# EAGLE design display-demo (EAGLE 4.16)
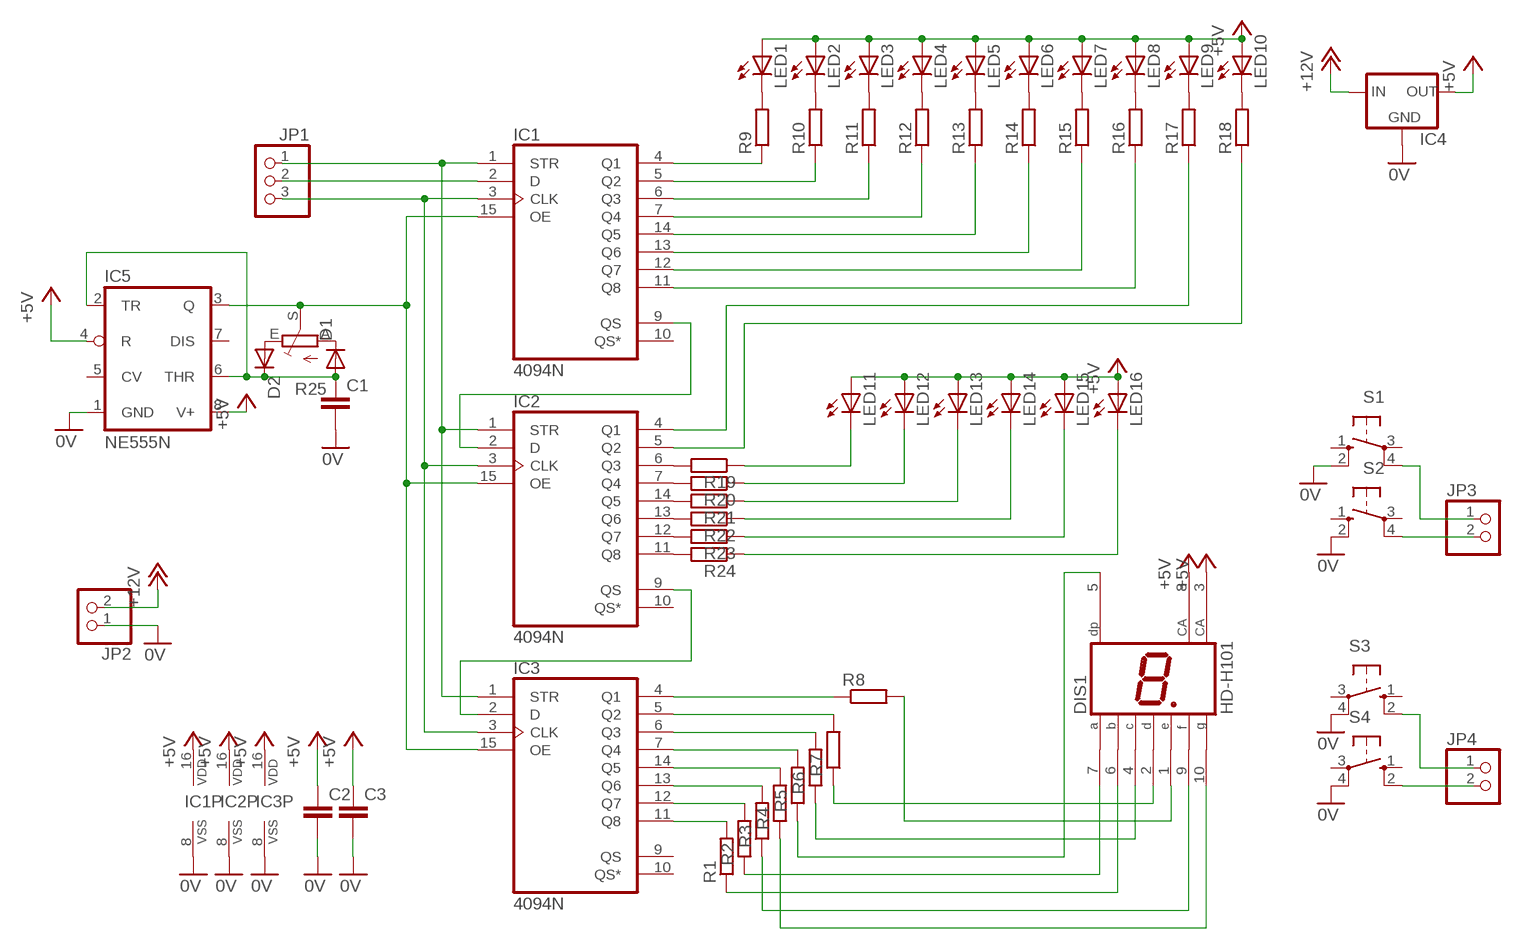
[diagram p0: schematic, sheet 1]

## Parts
C1  C-EU050-025X075  [C050-025X075]
C2  C-EU050-025X075  [C050-025X075]
C3  C-EU050-025X075  [C050-025X075]
D1  DIODE-D-5  [D-5]
D2  DIODE-D-5  [D-5]
DIS1  HD-H101  [HDSP-M]
IC1  4094N  [DIL16]
IC2  4094N  [DIL16]
IC3  4094N  [DIL16]
IC4  78XXL  [78XXL]
IC5  NE555N  [DIL08]
JP1  PINHD-1X3  [1X03]
JP2  PINHD-1X2  [1X02]
JP3  PINHD-1X2  [1X02]
JP4  PINHD-1X2  [1X02]
LED1  LED3MM  [LED3MM]
LED2  LED3MM  [LED3MM]
LED3  LED3MM  [LED3MM]
LED4  LED3MM  [LED3MM]
LED5  LED3MM  [LED3MM]
LED6  LED3MM  [LED3MM]
LED7  LED3MM  [LED3MM]
LED8  LED3MM  [LED3MM]
LED9  LED3MM  [LED3MM]
LED10  LED3MM  [LED3MM]
LED11  LED3MM  [LED3MM]
LED12  LED3MM  [LED3MM]
LED13  LED3MM  [LED3MM]
LED14  LED3MM  [LED3MM]
LED15  LED3MM  [LED3MM]
LED16  LED3MM  [LED3MM]
R1  R-EU_0204/7  [0204/7]
R2  R-EU_0204/7  [0204/7]
R3  R-EU_0204/7  [0204/7]
R4  R-EU_0204/7  [0204/7]
R5  R-EU_0204/7  [0204/7]
R6  R-EU_0204/7  [0204/7]
R7  R-EU_0204/7  [0204/7]
R8  R-EU_0204/7  [0204/7]
R9  R-EU_0204/7  [0204/7]
R10  R-EU_0204/7  [0204/7]
R11  R-EU_0204/7  [0204/7]
R12  R-EU_0204/7  [0204/7]
R13  R-EU_0204/7  [0204/7]
R14  R-EU_0204/7  [0204/7]
R15  R-EU_0204/7  [0204/7]
R16  R-EU_0204/7  [0204/7]
R17  R-EU_0204/7  [0204/7]
R18  R-EU_0204/7  [0204/7]
R19  R-EU_0204/7  [0204/7]
R20  R-EU_0204/7  [0204/7]
R21  R-EU_0204/7  [0204/7]
R22  R-EU_0204/7  [0204/7]
R23  R-EU_0204/7  [0204/7]
R24  R-EU_0204/7  [0204/7]
R25  TRIM_EU-PT10  [PT-10]
S1  10-XX  [B3F-10XX]
S2  10-XX  [B3F-10XX]
S3  10-XX  [B3F-10XX]
S4  10-XX  [B3F-10XX]

## Nets
0V: C1.2 C2.2 C3.2 IC1.8(VSS) IC2.8(VSS) IC3.8(VSS) IC4.GND IC5.1(GND) JP2.1 S1.2(S1) S2.2(S1) S3.4(P1) S4.4(P1)
+5V: C2.1 C3.1 DIS1.3(CA) DIS1.8(CA) IC1.16(VDD) IC2.16(VDD) IC3.16(VDD) IC4.OUT IC5.4(R) IC5.8(V+) LED1.A LED2.A LED3.A LED4.A LED5.A LED6.A LED7.A LED8.A LED9.A LED10.A LED11.A LED12.A LED13.A LED14.A LED15.A LED16.A
+12V: IC4.IN JP2.2
N$1: IC1.4(Q1) R9.1
N$2: IC1.5(Q2) R10.1
N$3: IC1.6(Q3) R11.1
N$4: IC1.7(Q4) R12.1
N$5: IC1.14(Q5) R13.1
N$6: IC1.13(Q6) R14.1
N$7: IC1.12(Q7) R15.1
N$8: IC1.11(Q8) R16.1
N$9: IC2.4(Q1) R17.1
N$10: IC2.5(Q2) R18.1
N$11: IC1.9(QS) IC2.2(D)
N$12: IC2.9(QS) IC3.2(D)
N$14: IC1.1(STR) IC2.1(STR) IC3.1(STR) JP1.1
N$15: DIS1.1(E) R8.2
N$16: DIS1.2(D) R7.1
N$17: DIS1.4(C) R6.1
N$18: D1.C R25.A
N$19: DIS1.6(B) R1.1
N$20: DIS1.7(A) R2.1
N$21: IC3.5(Q2) R7.2
N$22: IC3.4(Q1) R8.1
N$23: DIS1.9(F) R3.1
N$24: IC3.6(Q3) R6.2
N$25: IC3.7(Q4) R5.2
N$26: IC3.14(Q5) R4.2
N$27: IC3.13(Q6) R3.2
N$28: IC3.12(Q7) R2.2
N$29: IC3.11(Q8) R1.2
N$30: DIS1.5(DP) R5.1
N$31: LED1.K(C) R9.2
N$32: LED2.K(C) R10.2
N$33: LED3.K(C) R11.2
N$34: LED4.K(C) R12.2
N$35: LED5.K(C) R13.2
N$36: LED6.K(C) R14.2
N$37: LED7.K(C) R15.2
N$38: LED8.K(C) R16.2
N$39: LED9.K(C) R17.2
N$40: LED10.K(C) R18.2
N$41: JP3.2 S2.4(P1)
N$42: IC1.3(CLK) IC2.3(CLK) IC3.3(CLK) JP1.3
N$43: IC1.15(OE) IC2.15(OE) IC3.15(OE) IC5.3(Q) R25.S
N$44: IC2.6(Q3) R19.2
N$45: IC2.7(Q4) R20.2
N$46: IC2.14(Q5) R21.2
N$47: IC2.13(Q6) R22.2
N$48: IC2.12(Q7) R23.2
N$49: IC2.11(Q8) R24.2
N$50: LED16.K(C) R24.1
N$51: LED15.K(C) R23.1
N$52: LED14.K(C) R22.1
N$53: LED13.K(C) R21.1
N$54: LED12.K(C) R20.1
N$55: LED11.K(C) R19.1
N$56: JP3.1 S1.4(P1)
N$57: JP4.2 S4.2(S1)
N$58: JP4.1 S3.2(S1)
N$59: D2.A R25.E
N$61: DIS1.10(G) R4.1
N$62: C1.1 D1.A D2.C IC5.2(TR) IC5.6(THR)
N$67: IC1.2(D) JP1.2
Unconnected: IC1.10(QS*) IC2.10(QS*) IC3.9(QS) IC3.10(QS*) IC5.5(CV) IC5.7(DIS) S1.1(S) S1.3(P) S2.1(S) S2.3(P) S3.1(S) S3.3(P) S4.1(S) S4.3(P)

## Library data of the parts
C1-C3 = rcl:C-EU: CAPACITOR, European symbol
D1 D2 = diode:DIODE-: DIODE
DIS1 = display-hp:HD-H101: LED DISPLAY 1-character 7 segment, decimal point right
IC1-IC3 = 40xx:4094: 8-stage SHIFT/STORE REGISTER, tri-state
IC4 = v-reg:78XXL: VOLTAGE REGULATOR
IC5 = linear:*555: TIMER
JP1 = pinhead:PINHD-1X3: PIN HEADER
JP2-JP4 = pinhead:PINHD-1X2: PIN HEADER
LED1-LED16 = led:LED: LED OSRAM: - CHIPLED LG R971, LG N971, LY N971, LG Q971, LY Q971, LO R971, LY R971 LH N974, LH R974 LS Q976, LO Q976, LY Q976 LO Q996 - Hyper CHIPLED LW Q18S LB Q993, LB Q99A, LB R99A - SideLED LS A670, LO A670, LY A670, LG A670, LP A670 LB A673, LV A673, LT A673, LW A673 LH A674 LY A675 LS A676, LA A676, LO A676, LY A676, LW A676 LS A679, LY A679, LG A679 - Hyper Micro SIDELED® LS Y876, LA Y876, LO Y876, LY Y876 LT Y87S - SmartLED LW L88C, LW L88S LB L89C, LB L89S, LG L890 LS L89K, LO L89K, LY L89K LS L896, LA L896, LO L896, LY L896 - TOPLED LS T670, LO T670, LY T670, LG T670, LP T670 LSG T670, LSP T670, LSY T670, LOP T670, LYG T670 LG T671, LOG T671, LSG T671 LB T673, LV T673, LT T673, LW T673 LH T674 LS T676, LA T676, LO T676, LY T676, LB T676, LH T676, LSB T676, LW T676 LB T67C, LV T67C, LT T67C, LS T67K, LO T67K, LY T67K, LW E67C LS E67B, LA E67B, LO E67B, LY E67B, LB E67C, LV E67C, LT E67C LW T67C LS T679, LY T679, LG T679 LS T770, LO T770, LY T770, LG T770, LP T770 LB T773, LV T773, LT T773, LW T773 LH T774 LS E675, LA E675, LY E675, LS T675 LS T776, LA T776, LO T776, LY T776, LB T776 LHGB T686 LT T68C, LB T68C - Hyper Mini TOPLED® LB M676 - Mini TOPLED Santana® LG M470 LS M47K, LO M47K, LY M47K Source: http://www.osram.convergy.de/
R1-R24 = rcl:R-EU_: RESISTOR, European symbol
R25 = pot:TRIM_EU-: POTENTIOMETER
S1-S4 = switch-omron:10-XX: OMRON SWITCH

## Board
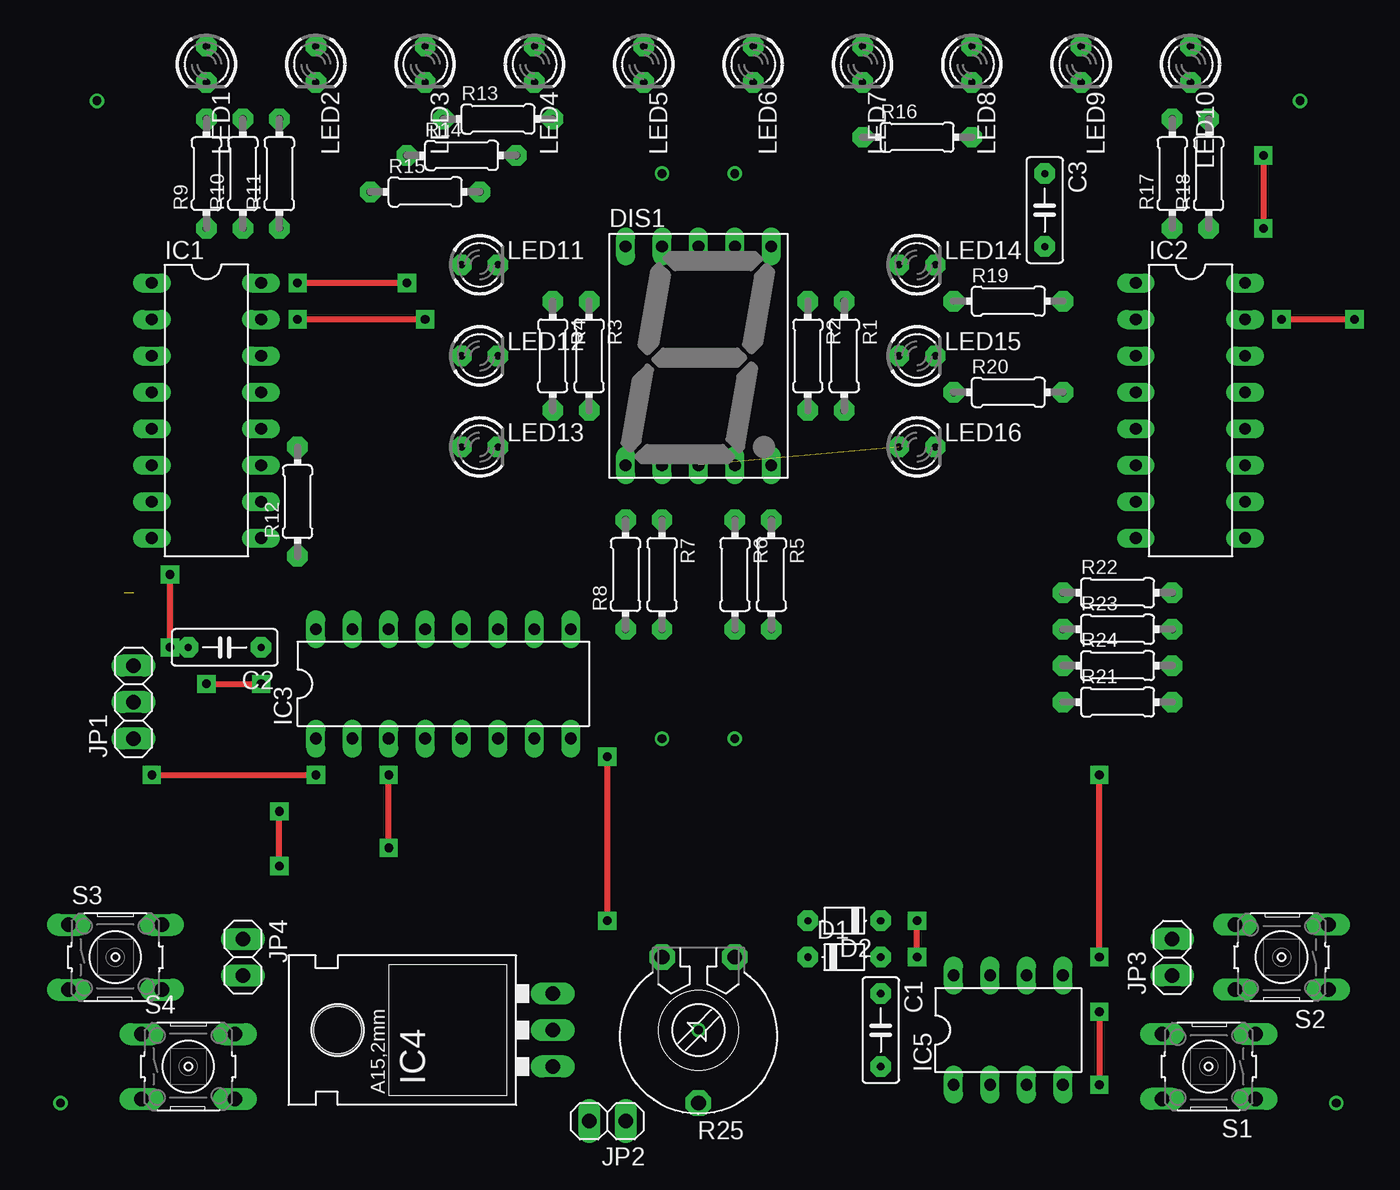
[diagram p1: board, top side]
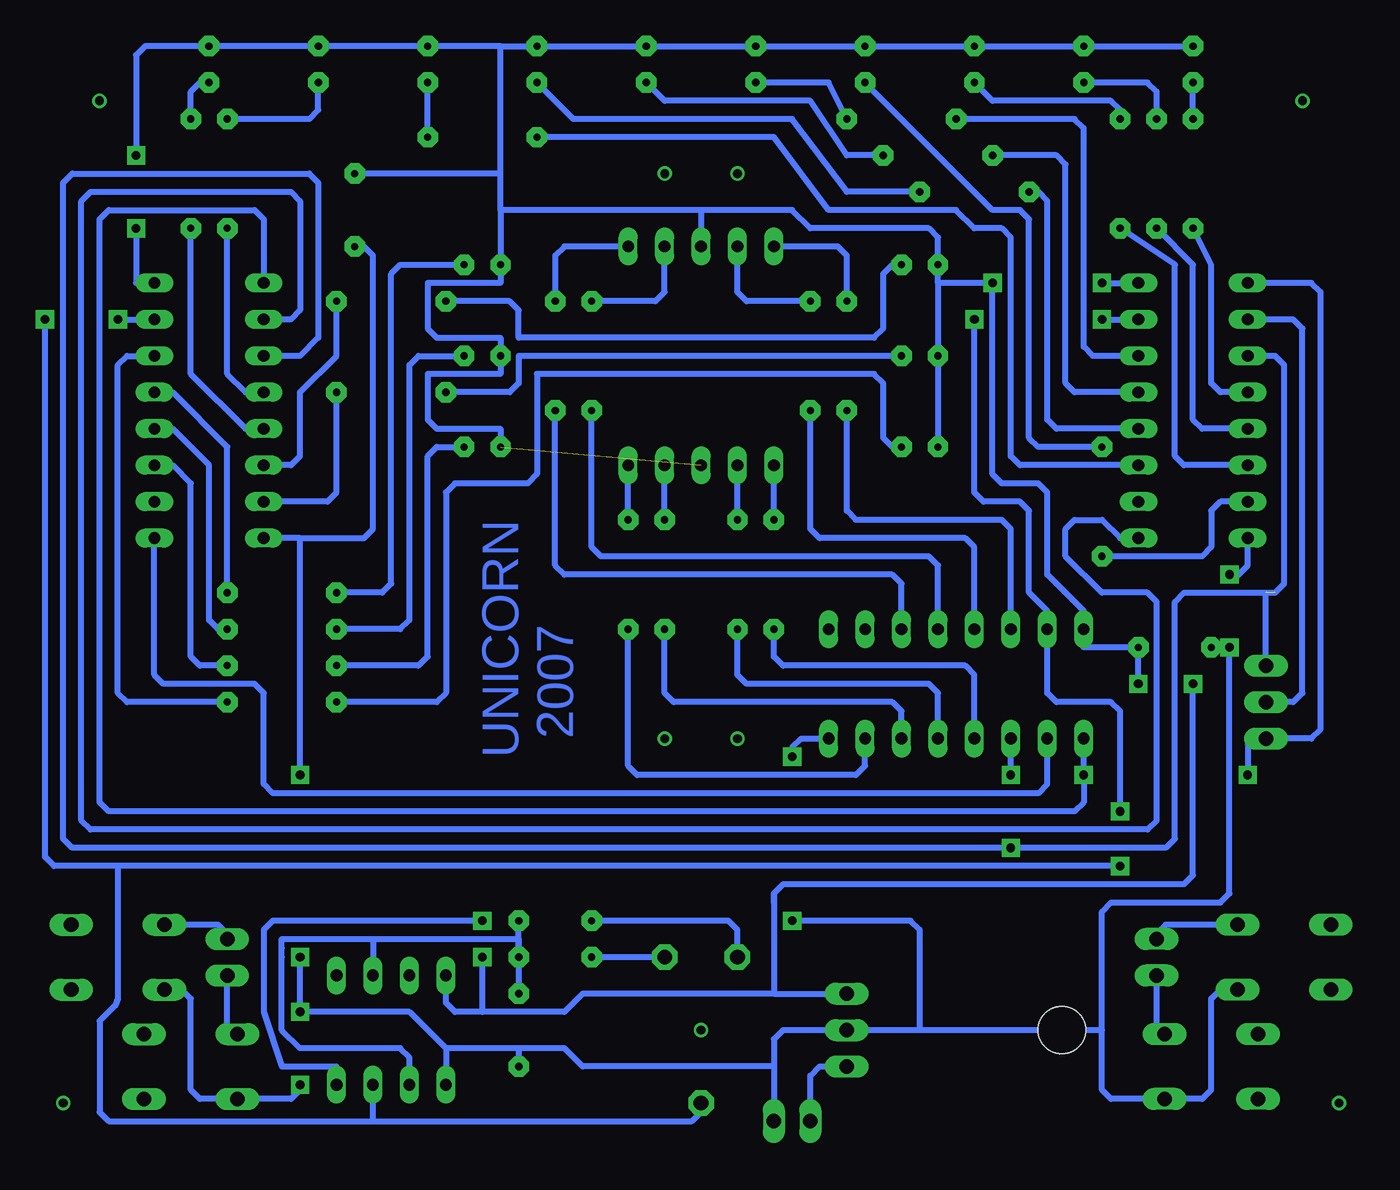
[diagram p2: board, bottom side, seen from below]

No outline drawn. Coordinates in mm, seen from the top.
Copper layers (1*16): Top 0.035mm / dielectric 1.5mm / Bottom 0.035mm
Design rules "default": minimum track width 10mil, minimum drill 24mil, track to track 8mil, track to pad 8mil, pad to pad 8mil, via to via 8mil, smd to smd 8mil, copper to edge 40mil, drill to drill 8mil, minimum pad ring 10mil, minimum via ring 8mil, stop-mask expansion 4mil, vias tented up to drill 0mil, thermal gap 10mil

### Footprints (pad centres in the part's own frame; a part is rotated, then mirrored left to right if it is on the bottom)
C050-025X075 = drill 0.5 pad 1.422 octagon: 1 -2.54,0; 2 2.54,0
D-5 = drill 0.5 pad 1.422 octagon: A 2.54,0; C -2.54,0
HDSP-M = drill 0.813 long: 1 -5.08,-7.62; 2 -2.54,-7.62; 3 0,-7.62; 4 2.54,-7.62; 5 5.08,-7.62; 6 5.08,7.62; 7 2.54,7.62; 8 0,7.62; 9 -2.54,7.62; 10 -5.08,7.62
DIL16 = drill 0.813 long: 1 -8.89,-3.81; 2 -6.35,-3.81; 3 -3.81,-3.81; 4 -1.27,-3.81; 5 1.27,-3.81; 6 3.81,-3.81; 7 6.35,-3.81; 8 8.89,-3.81; 9 8.89,3.81; 10 6.35,3.81; 11 3.81,3.81; 12 1.27,3.81; 13 -1.27,3.81; 14 -3.81,3.81; 15 -6.35,3.81; 16 -8.89,3.81
78XXL = drill 1.016 long: GND 0,-3.81; IN -2.54,-3.81; OUT 2.54,-3.81 | hole 3.302: 0,11.176
DIL08 = drill 0.813 long: 1 -3.81,-3.81; 2 -1.27,-3.81; 3 1.27,-3.81; 4 3.81,-3.81; 5 3.81,3.81; 6 1.27,3.81; 7 -1.27,3.81; 8 -3.81,3.81
1X03 = drill 1.016 long: 1 -2.54,0; 2 0,0; 3 2.54,0
1X02 = drill 1.016 long: 1 -1.27,0; 2 1.27,0
LED3MM = drill 0.5 pad 1.422 octagon: A -1.27,0; K 1.27,0
0204/7 = drill 0.5 pad 1.422 octagon: 1 -3.81,0; 2 3.81,0
PT-10 = drill 1.016 pad 1.778 octagon: A -2.54,-5.08; E 2.54,-5.08; S 0,5.08
B3F-10XX = drill 1.016 long: 1 -3.251,2.261; 2 3.251,2.261; 3 -3.251,-2.261; 4 3.251,-2.261

### Placement (x,y rotation side)
C1  64.77,7.62 270 top
C2  19.05,34.29 180 top
C3  76.2,64.77 270 top
D1  62.23,12.7 0 top
D2  62.23,15.24 180 top
DIS1  52.07,54.61 0 top
IC1  17.78,50.8 270 top
IC2  86.36,50.8 270 top
IC3  34.29,31.75 0 top
IC4  38.1,7.62 90 top
IC5  73.66,7.62 0 top
JP1  12.7,30.48 90 top
JP2  45.72,1.27 180 top
JP3  85.09,12.7 90 top
JP4  20.32,12.7 270 top
LED1  17.78,74.93 270 top
LED2  25.4,74.93 270 top
LED3  33.02,74.93 270 top
LED4  40.64,74.93 270 top
LED5  48.26,74.93 270 top
LED6  55.88,74.93 270 top
LED7  63.5,74.93 270 top
LED8  71.12,74.93 270 top
LED9  78.74,74.93 270 top
LED10  86.36,74.93 270 top
LED11  36.83,60.96 0 top
LED12  36.83,54.61 0 top
LED13  36.83,48.26 0 top
LED14  67.31,60.96 0 top
LED15  67.31,54.61 0 top
LED16  67.31,48.26 0 top
R1  62.23,54.61 270 top
R2  59.69,54.61 270 top
R3  44.45,54.61 270 top
R4  41.91,54.61 270 top
R5  57.15,39.37 270 top
R6  54.61,39.37 270 top
R7  49.53,39.37 270 top
R8  46.99,39.37 90 top
R9  17.78,67.31 90 top
R10  20.32,67.31 90 top
R11  22.86,67.31 90 top
R12  24.13,44.45 90 top
R13  38.1,71.12 0 top
R14  35.56,68.58 0 top
R15  33.02,66.04 0 top
R16  67.31,69.85 0 top
R17  85.09,67.31 90 top
R18  87.63,67.31 90 top
R19  73.66,58.42 0 top
R20  73.66,52.07 0 top
R21  81.28,30.48 0 top
R22  81.28,38.1 0 top
R23  81.28,35.56 0 top
R24  81.28,33.02 0 top
R25  52.07,7.62 180 top
S1  87.63,5.08 180 top
S2  92.71,12.7 180 top
S3  11.43,12.7 0 top
S4  16.51,5.08 0 top

### Tracks (layer width: path | path; a pad name or v marks a point on that pad's centre or on a via)
0V  (via drill 0.6, 0.6 pad 1.27)
  Top 0.406: v15.24,34.29 v15.24,39.37 | v80.01,12.7 v80.01,25.4 | v45.72,15.24 v45.72,26.67 | v80.01,8.89 v80.01,3.81
  Bottom 0.406: 80.01,41.91 IC2.8 | 46.99,5.08 JP2.1 | 24.13,7.62 v26.67,7.62 36.83,7.62 | 36.83,7.62 IC4.GND 46.35,7.62 46.99,6.99 46.99,5.08 | 46.99,5.08 60.33,5.08 61.59,6.35 64.77,6.35 | 64.77,6.35 C1.2 | 64.77,6.35 69.85,6.35 | 69.85,6.35 72.39,8.89 v80.01,8.89 v80.01,12.7 | 69.85,6.35 IC5.1 | v15.24,39.37 14.61,39.37 13.97,40.01 IC1.8 | v80.01,25.4 80.01,41.91 | 24.13,7.62 24.13,15.88 23.5,16.51 15.88,16.51 15.24,17.14 v15.24,34.29 C2.2 | v45.72,26.67 45.72,27.3 45.09,27.94 IC3.8 | 36.83,7.62 36.83,14.61 37.47,15.24 v45.72,15.24 | 80.01,41.91 75.56,41.91 74.93,42.55 74.93,61.59 75.56,62.23 C3.2 | S2.2 88.27,10.44 87.63,9.8 87.63,3.45 87,2.82 S1.2 80.64,2.82 80.01,3.45 v80.01,3.81 | S3.4 15.88,10.44 16.51,9.8 16.51,3.45 17.14,2.82 S4.4 23.5,2.82 24.13,3.45 24.13,7.62
+5V  (via drill 0.6 pad 1.27)  (1 unrouted)
  Top 0.406: v31.75,59.69 v24.13,59.69 | v91.44,68.58 v91.44,63.5 | v17.78,31.75 v21.59,31.75 | v67.31,12.7 v67.31,15.24
  Bottom 0.406: LED2.A LED1.A | LED3.A LED2.A | LED4.A LED3.A | LED5.A LED4.A | LED6.A LED5.A | LED7.A LED6.A | LED8.A LED9.A | LED9.A LED10.A 90.81,76.2 91.44,75.56 v91.44,68.58 | LED3.A LED2.A | LED4.A LED3.A | LED5.A LED4.A | LED6.A LED5.A | LED7.A LED6.A | 66.04,76.2 LED7.A | 66.04,76.2 LED8.A | LED8.A LED9.A | LED13.A LED12.A 35.56,59.69 | 52.07,64.77 45.72,64.77 44.45,63.5 36.2,63.5 35.56,62.87 LED11.A 35.56,59.69 | 52.07,64.77 DIS1.8 | 66.04,64.77 LED14.A 66.04,59.69 71.12,59.69 71.12,56.52 70.48,55.88 66.04,55.88 LED15.A 66.04,53.34 71.12,53.34 71.12,50.16 70.48,49.53 66.04,49.53 LED16.A | 52.07,64.77 66.04,64.77 | 46.99,10.16 60.33,10.16 61.59,8.89 67.31,8.89 | 67.31,8.89 69.22,8.89 69.85,9.53 IC5.8 | 66.04,64.77 66.04,67.31 | 66.04,67.31 66.04,76.2 | v24.13,59.69 IC1.16 | IC2.16 91.44,59.69 v91.44,63.5 | 35.56,59.69 v31.75,59.69 31.75,46.35 31.11,45.72 28.57,45.72 27.94,45.09 27.94,39.37 25.4,36.83 IC3.16 25.4,34.29 C2.1 v21.59,31.75 | 66.04,67.31 C3.1 | 46.99,10.16 IC4.OUT | 46.99,16.51 46.99,10.16 | 46.99,16.51 46.99,17.14 | v17.78,31.75 17.78,18.41 18.41,17.78 46.35,17.78 46.99,17.14 | IC5.4 77.47,5.08 81.28,5.08 82.55,8.89 82.55,14.61 81.92,15.24 v67.31,15.24 | 67.31,8.89 v67.31,12.7 | 46.99,17.14 46.99,16.51
+12V
  Bottom 0.406: JP2.2 44.45,4.45 43.81,5.08 IC4.IN
N$1
  Bottom 0.406: IC1.4 15.88,52.07 16.51,52.7 16.51,60.96 R9.1
N$2
  Bottom 0.406: R10.1 17.78,60.96 17.78,50.16 17.14,49.53 IC1.5
N$3
  Bottom 0.406: R11.1 19.05,60.96 19.05,47.62 18.41,46.99 IC1.6
N$4
  Bottom 0.406: IC1.7 15.88,44.45 16.51,43.81 16.51,41.27 17.14,40.64 R12.1
N$5
  Bottom 0.406: R13.1 26.04,71.12 25.4,70.48 25.4,55.24 24.77,54.61 IC1.14
N$6
  Bottom 0.406: R14.1 27.3,68.58 26.67,67.94 26.67,52.7 26.04,52.07 IC1.13
N$7
  Bottom 0.406: R15.1 28.57,66.04 27.94,65.41 27.94,50.16 27.3,49.53 IC1.12
N$8
  Bottom 0.406: R16.1 46.99,69.85 43.18,64.77 34.29,64.77 33.02,63.5 31.11,63.5 30.48,62.87 30.48,47.62 29.84,46.99 IC1.11
N$9
  Bottom 0.406: R17.1 85.09,53.34 83.82,52.07 IC2.4
N$10
  Bottom 0.406: R18.1 87.63,53.34 83.82,49.53 IC2.5
N$11
  Bottom 0.406: IC2.2 80.64,57.15 80.01,57.78 80.01,65.41 80.64,66.04 94.61,66.04 95.25,65.41 95.25,22.23 94.61,21.59 20.95,21.59 20.32,22.23 20.32,37.47 20.95,38.1 24.13,38.1 26.67,40.64 26.67,42.55 26.04,43.18 24.13,43.18 22.86,41.91 IC1.9
N$12
  Bottom 0.406: IC3.2 27.94,24.77 28.57,24.13 81.92,24.13 82.55,24.77 82.55,31.11 83.19,31.75 89.53,31.75 90.17,32.38 IC2.9
N$13  (via drill 0.6)
  other vias: 96.52,2.54
N$14  (via drill 0.6 pad 1.27)
  Top 0.406: v13.97,25.4 v25.4,25.4
  Bottom 0.406: IC2.1 82.55,64.14 83.19,64.77 93.34,64.77 93.98,64.14 93.98,23.5 93.34,22.86 26.04,22.86 25.4,23.5 v25.4,25.4 IC3.1 | IC1.1 9.53,59.69 8.89,59.05 8.89,28.57 9.53,27.94 JP1.1 13.97,27.94 v13.97,25.4
N$15
  Bottom 0.406: R8.2 DIS1.1
N$16
  Bottom 0.406: R7.1 DIS1.2
N$17
  Bottom 0.406: R6.1 DIS1.4
N$18
  Bottom 0.406: R25.A D1.C
N$19
  Bottom 0.406: DIS1.6 61.59,62.23 62.23,61.59 R1.1
N$20
  Bottom 0.406: R2.1 55.24,58.42 54.61,59.05 DIS1.7
N$21
  Bottom 0.406: IC3.5 35.56,31.11 36.2,31.75 48.9,31.75 49.53,32.38 R7.2
N$22
  Bottom 0.406: IC3.4 33.02,32.38 33.66,33.02 46.35,33.02 46.99,33.66 R8.1
N$23
  Bottom 0.406: R3.1 48.9,58.42 49.53,59.05 DIS1.9
N$24
  Bottom 0.406: IC3.6 38.1,29.84 38.73,30.48 53.98,30.48 54.61,31.11 R6.2
N$25
  Bottom 0.406: IC3.7 40.64,26.04 41.27,25.4 56.52,25.4 57.15,26.04 R5.2
N$26
  Bottom 0.406: IC3.14 30.48,42.55 31.11,43.18 41.27,43.18 41.91,43.81 R4.2
N$27
  Bottom 0.406: IC3.13 33.02,41.27 33.66,41.91 43.81,41.91 44.45,42.55 R3.2
N$28
  Bottom 0.406: IC3.12 35.56,40.01 36.2,40.64 59.05,40.64 59.69,41.27 R2.2
N$29
  Bottom 0.406: IC3.11 38.1,38.73 38.73,39.37 61.59,39.37 62.23,40.01 R1.2
N$30
  Bottom 0.406: R5.1 DIS1.5
N$31
  Bottom 0.406: R9.2 LED1.K
N$32
  Bottom 0.406: R10.2 20.32,73.03 20.95,73.66 LED2.K
N$33
  Bottom 0.406: R11.2 22.86,71.75 23.5,72.39 31.75,72.39 LED3.K
N$34
  Bottom 0.406: LED4.K 31.75,64.77 29.84,64.77 29.21,64.14 29.21,48.9 28.57,48.26 R12.2
N$35
  Bottom 0.406: R13.2 43.18,73.66 LED5.K
N$36
  Bottom 0.406: R14.2 41.91,68.58 44.45,72.39 54.61,72.39 LED6.K
N$37
  Bottom 0.406: R15.2 41.91,66.04 45.72,71.12 60.96,71.12 LED7.K
N$38
  Bottom 0.406: R16.2 LED8.K
N$39
  Bottom 0.406: LED9.K 78.74,71.75 79.38,71.12 R17.2
N$40
  Bottom 0.406: R18.2 87.63,73.03 87,73.66 LED10.K
N$41
  Bottom 0.406: JP3.2 85.09,14.33 85.72,14.96 S2.4
N$42  (via drill 0.6 pad 1.27)  (1 unrouted)
  Top 0.406: v30.48,20.32 v30.48,25.4
  Bottom 0.406: IC2.3 80.01,54.61 78.74,55.88 78.74,66.67 79.38,67.31 95.89,67.31 96.52,66.67 96.52,20.95 95.89,20.32 v30.48,20.32 19.68,20.32 19.05,20.95 19.05,37.47 18.41,38.1 12.06,38.1 11.43,38.73 11.43,53.98 12.06,54.61 IC1.3 | v30.48,25.4 IC3.3 | JP1.3 12.7,38.1
N$43  (via drill 0.6 pad 1.27)
  Top 0.406: v33.02,57.15 v24.13,57.15 | v97.79,57.15 v92.71,57.15 | v22.86,19.05 v22.86,22.86
  Bottom 0.406: 74.93,1.27 52.7,1.27 52.07,1.91 R25.S | 74.93,1.27 IC5.3 | v33.02,57.15 33.02,45.09 32.38,44.45 29.84,44.45 29.21,43.81 29.21,38.1 27.94,36.83 IC3.15 27.94,31.11 27.3,30.48 23.5,30.48 22.86,29.84 v22.86,22.86 | v24.13,57.15 IC1.15 | v92.71,57.15 IC2.15 | v22.86,19.05 92.71,19.05 | 92.71,19.05 97.16,19.05 97.79,19.68 v97.79,57.15 | 92.71,19.05 92.71,9.79 92.9,9.34 93.98,8.26 93.98,1.91 93.34,1.27 74.93,1.27
N$44
  Bottom 0.406: R19.2 77.47,54.61 80.01,52.07 80.01,47.62 80.64,46.99 IC2.6
N$45
  Bottom 0.406: R20.2 77.47,45.09 78.11,44.45 IC2.7
N$46
  Bottom 0.406: R21.2 92.08,30.48 92.71,31.11 92.71,53.98 92.08,54.61 IC2.14
N$47
  Bottom 0.406: R22.2 85.09,48.26 88.9,52.07 IC2.13
N$48
  Bottom 0.406: IC2.12 88.9,49.53 86.36,46.99 86.36,36.2 85.72,35.56 R23.2
N$49
  Bottom 0.406: R24.2 87,33.02 87.63,33.66 87.63,45.72 88.9,46.99 IC2.11
N$50
  Bottom 0.406: LED16.K 70.48,48.26 71.12,47.62 71.12,33.66 71.75,33.02 R24.1
N$51
  Bottom 0.406: LED15.K 71.75,54.61 72.39,53.98 72.39,36.2 73.03,35.56 R23.1
N$52
  Bottom 0.406: LED14.K 73.03,60.96 73.66,60.33 73.66,38.73 74.3,38.1 R22.1
N$53
  Bottom 0.406: LED13.K 38.73,48.26 39.37,48.9 39.37,52.7 40.01,53.34 63.5,53.34 63.5,46.35 64.14,45.72 69.22,45.72 69.85,45.09 69.85,31.11 70.48,30.48 R21.1
N$54
  Bottom 0.406: LED12.K 64.77,54.61 64.77,52.7 65.41,52.07 R20.1
N$55
  Bottom 0.406: LED11.K 38.73,60.96 39.37,60.33 39.37,56.52 40.01,55.88 64.77,55.88 64.77,57.78 65.41,58.42 R19.1
N$56
  Bottom 0.406: S1.4 85.09,7.34 JP3.1
N$57
  Bottom 0.406: S4.2 20.32,7.34 JP4.2
N$58
  Bottom 0.406: S3.2 19.68,14.96 20.32,14.33 JP4.1
N$59
  Bottom 0.406: R25.E 49.53,14.61 50.16,15.24 D2.A
N$60  (via drill 0.6)
  other vias: 52.07,7.62
N$61
  Bottom 0.406: R4.1 41.91,61.59 42.55,62.23 DIS1.10
N$62
  Bottom 0.406: D1.A D2.C | D1.A C1.1 | 74.93,13.97 64.77,13.97 D1.A | 74.93,13.97 IC5.6 | 81.28,12.7 81.28,7.62 80.01,6.35 73.03,6.35 72.39,5.71 IC5.2 | 81.28,12.7 81.28,13.34 | 74.93,13.97 81.28,13.97 81.28,12.7
N$63  (via drill 0.6)
  other vias: 49.53,27.94
N$64  (via drill 0.6)
  other vias: 54.61,27.94
N$65  (via drill 0.6)
  other vias: 54.61,67.31
N$66  (via drill 0.6)
  other vias: 49.53,67.31
N$67
  Bottom 0.406: JP1.2 10.79,30.48 10.16,31.11 10.16,56.52 10.79,57.15 IC1.2
N$68  (via drill 0.6)
  other vias: 7.62,2.54
N$69  (via drill 0.6)
  other vias: 10.16,72.39
N$70  (via drill 0.6)
  other vias: 93.98,72.39

### Text on the board
Bottom: UNICORN | 2007